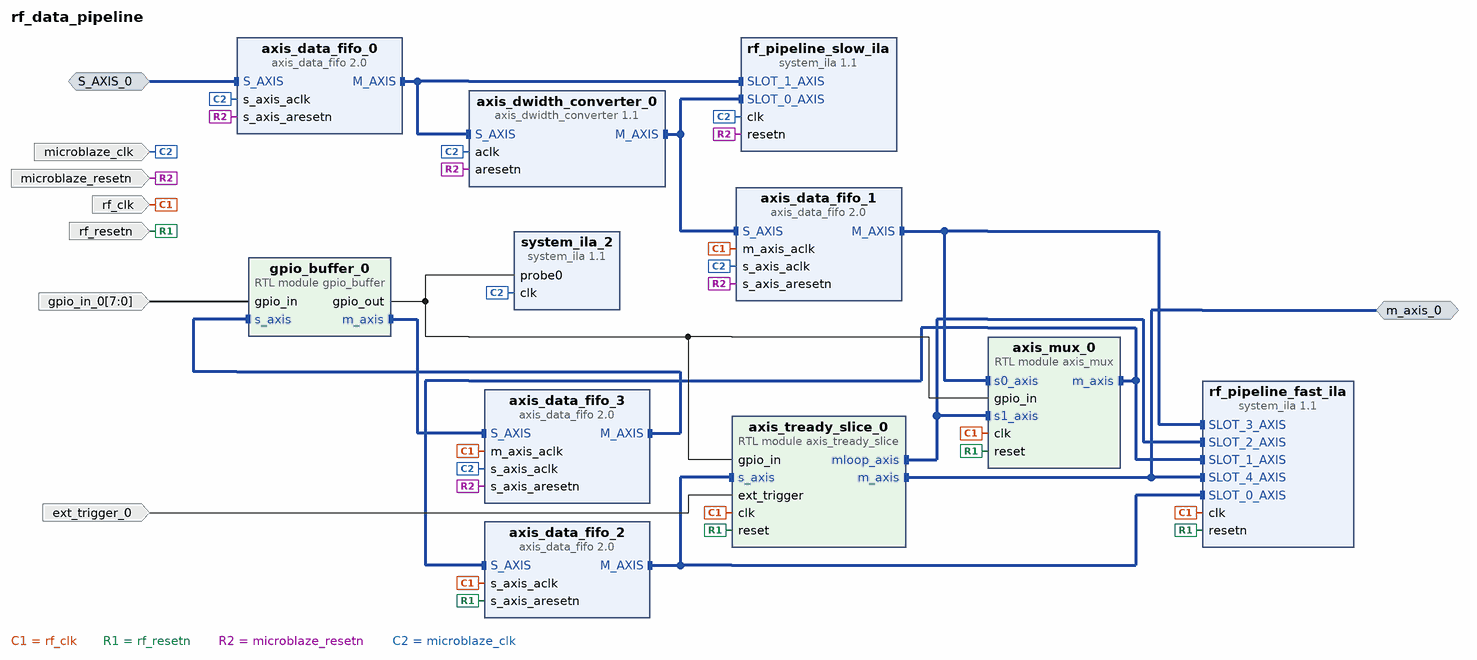
[diagram p0: block diagram of the top level]
# Vivado block design rf_data_pipeline, xczu29dr-ffvf1760-2-e, Vivado 2019.1
create_bd_design rf_data_pipeline

create_bd_intf_port -mode Slave -vlnv xilinx.com:interface:axis_rtl:1.0 S_AXIS_0
set_property -dict [list \
  CONFIG.HAS_TKEEP 0 \
  CONFIG.HAS_TLAST 0 \
  CONFIG.HAS_TREADY 1 \
  CONFIG.HAS_TSTRB 0 \
  CONFIG.LAYERED_METADATA undef \
  CONFIG.TDATA_NUM_BYTES 4 \
  CONFIG.TDEST_WIDTH 0 \
  CONFIG.TID_WIDTH 0 \
  CONFIG.TUSER_WIDTH 0 \
] [get_bd_intf_ports S_AXIS_0]
create_bd_intf_port -mode Master -vlnv xilinx.com:interface:axis_rtl:1.0 m_axis_0
set_property -dict {CONFIG.FREQ_HZ 250000000} [get_bd_intf_ports m_axis_0]
create_bd_port -dir I ext_trigger_0
create_bd_port -dir I -type clk rf_clk
set_property -dict {CONFIG.ASSOCIATED_RESET rf_resetn CONFIG.FREQ_HZ 250000000} [get_bd_ports rf_clk]
create_bd_port -dir I -type clk microblaze_clk
set_property -dict {CONFIG.ASSOCIATED_RESET microblaze_resetn CONFIG.FREQ_HZ 100000000} [get_bd_ports microblaze_clk]
create_bd_port -dir I -from 7 -to 0 gpio_in_0
create_bd_port -dir I -type rst microblaze_resetn
create_bd_port -dir I -type rst rf_resetn

create_bd_cell -type ip -vlnv xilinx.com:ip:axis_data_fifo:2.0 axis_data_fifo_0
set_property -dict {CONFIG.FIFO_DEPTH 16 CONFIG.HAS_TLAST 0 CONFIG.TDATA_NUM_BYTES 4} [get_bd_cells axis_data_fifo_0]
create_bd_cell -type ip -vlnv xilinx.com:ip:axis_dwidth_converter:1.1 axis_dwidth_converter_0
set_property -dict [list \
  CONFIG.HAS_MI_TKEEP 0 \
  CONFIG.HAS_TKEEP 0 \
  CONFIG.HAS_TLAST 0 \
  CONFIG.HAS_TSTRB 0 \
  CONFIG.M_TDATA_NUM_BYTES 32 \
  CONFIG.S_TDATA_NUM_BYTES 4 \
] [get_bd_cells axis_dwidth_converter_0]
create_bd_cell -type ip -vlnv xilinx.com:ip:axis_data_fifo:2.0 axis_data_fifo_1
set_property -dict [list \
  CONFIG.FIFO_DEPTH 64 \
  CONFIG.FIFO_MODE 1 \
  CONFIG.HAS_PROG_FULL 0 \
  CONFIG.HAS_TKEEP 0 \
  CONFIG.HAS_TLAST 0 \
  CONFIG.IS_ACLK_ASYNC 1 \
  CONFIG.TDATA_NUM_BYTES 32 \
] [get_bd_cells axis_data_fifo_1]
create_bd_cell -type ip -vlnv xilinx.com:ip:axis_data_fifo:2.0 axis_data_fifo_2
set_property -dict {CONFIG.FIFO_DEPTH 1024 CONFIG.TDATA_NUM_BYTES 32} [get_bd_cells axis_data_fifo_2]
create_bd_cell -type module -reference axis_mux axis_mux_0
create_bd_cell -type ip -vlnv xilinx.com:ip:system_ila:1.1 rf_pipeline_fast_ila
set_property -dict [list \
  CONFIG.ALL_PROBE_SAME_MU_CNT 1 \
  CONFIG.C_DATA_DEPTH 4096 \
  CONFIG.C_EN_STRG_QUAL 0 \
  CONFIG.C_MON_TYPE INTERFACE \
  CONFIG.C_NUM_MONITOR_SLOTS 5 \
  CONFIG.C_PROBE0_MU_CNT 1 \
  CONFIG.C_SLOT_0_APC_EN 0 \
  CONFIG.C_SLOT_0_AXI_DATA_SEL 1 \
  CONFIG.C_SLOT_0_AXI_TRIG_SEL 1 \
  CONFIG.C_SLOT_0_INTF_TYPE xilinx.com:interface:axis_rtl:1.0 \
  CONFIG.C_SLOT_1_APC_EN 0 \
  CONFIG.C_SLOT_1_AXI_DATA_SEL 1 \
  CONFIG.C_SLOT_1_AXI_TRIG_SEL 1 \
  CONFIG.C_SLOT_1_INTF_TYPE xilinx.com:interface:axis_rtl:1.0 \
  CONFIG.C_SLOT_2_APC_EN 0 \
  CONFIG.C_SLOT_2_AXI_DATA_SEL 1 \
  CONFIG.C_SLOT_2_AXI_TRIG_SEL 1 \
  CONFIG.C_SLOT_2_INTF_TYPE xilinx.com:interface:axis_rtl:1.0 \
  CONFIG.C_SLOT_3_APC_EN 0 \
  CONFIG.C_SLOT_3_AXI_DATA_SEL 1 \
  CONFIG.C_SLOT_3_AXI_TRIG_SEL 1 \
  CONFIG.C_SLOT_3_INTF_TYPE xilinx.com:interface:axis_rtl:1.0 \
  CONFIG.C_SLOT_4_APC_EN 0 \
  CONFIG.C_SLOT_4_AXI_DATA_SEL 1 \
  CONFIG.C_SLOT_4_AXI_TRIG_SEL 1 \
  CONFIG.C_SLOT_4_INTF_TYPE xilinx.com:interface:axis_rtl:1.0 \
] [get_bd_cells rf_pipeline_fast_ila]
create_bd_cell -type module -reference gpio_buffer gpio_buffer_0
create_bd_cell -type ip -vlnv xilinx.com:ip:axis_data_fifo:2.0 axis_data_fifo_3
set_property -dict {CONFIG.FIFO_DEPTH 16 CONFIG.IS_ACLK_ASYNC 1} [get_bd_cells axis_data_fifo_3]
create_bd_cell -type module -reference axis_tready_slice axis_tready_slice_0
create_bd_cell -type ip -vlnv xilinx.com:ip:system_ila:1.1 rf_pipeline_slow_ila
set_property -dict [list \
  CONFIG.C_MON_TYPE INTERFACE \
  CONFIG.C_NUM_MONITOR_SLOTS 2 \
  CONFIG.C_SLOT_0_APC_EN 0 \
  CONFIG.C_SLOT_0_AXI_DATA_SEL 1 \
  CONFIG.C_SLOT_0_AXI_TRIG_SEL 1 \
  CONFIG.C_SLOT_0_INTF_TYPE xilinx.com:interface:axis_rtl:1.0 \
  CONFIG.C_SLOT_1_APC_EN 0 \
  CONFIG.C_SLOT_1_AXI_DATA_SEL 1 \
  CONFIG.C_SLOT_1_AXI_TRIG_SEL 1 \
  CONFIG.C_SLOT_1_INTF_TYPE xilinx.com:interface:axis_rtl:1.0 \
] [get_bd_cells rf_pipeline_slow_ila]
create_bd_cell -type ip -vlnv xilinx.com:ip:system_ila:1.1 system_ila_2
set_property -dict {CONFIG.C_MON_TYPE NATIVE CONFIG.C_NUM_OF_PROBES 1 CONFIG.C_PROBE0_TYPE 0} [get_bd_cells system_ila_2]

# ---- connections ----

connect_bd_intf_net -intf_net axis_tready_slice_0_mloop_axis [get_bd_intf_pins axis_tready_slice_0/mloop_axis] [get_bd_intf_pins axis_mux_0/s1_axis]
connect_bd_intf_net [get_bd_intf_pins axis_tready_slice_0/mloop_axis] [get_bd_intf_pins rf_pipeline_fast_ila/SLOT_2_AXIS]
connect_bd_intf_net -intf_net axis_dwidth_converter_0_M_AXIS [get_bd_intf_pins axis_dwidth_converter_0/M_AXIS] [get_bd_intf_pins axis_data_fifo_1/S_AXIS]
connect_bd_intf_net [get_bd_intf_pins axis_dwidth_converter_0/M_AXIS] [get_bd_intf_pins rf_pipeline_slow_ila/SLOT_0_AXIS]
connect_bd_intf_net -intf_net axis_mux_0_m_axis [get_bd_intf_pins axis_mux_0/m_axis] [get_bd_intf_pins axis_data_fifo_2/S_AXIS]
connect_bd_intf_net [get_bd_intf_pins axis_mux_0/m_axis] [get_bd_intf_pins rf_pipeline_fast_ila/SLOT_1_AXIS]
connect_bd_intf_net [get_bd_intf_pins axis_data_fifo_3/M_AXIS] [get_bd_intf_pins gpio_buffer_0/s_axis]
connect_bd_intf_net -intf_net axis_tready_slice_0_m_axis [get_bd_intf_ports m_axis_0] [get_bd_intf_pins axis_tready_slice_0/m_axis]
connect_bd_intf_net [get_bd_intf_ports m_axis_0] [get_bd_intf_pins rf_pipeline_fast_ila/SLOT_4_AXIS]
connect_bd_intf_net -intf_net axis_data_fifo_0_M_AXIS [get_bd_intf_pins axis_data_fifo_0/M_AXIS] [get_bd_intf_pins axis_dwidth_converter_0/S_AXIS]
connect_bd_intf_net [get_bd_intf_pins axis_data_fifo_0/M_AXIS] [get_bd_intf_pins rf_pipeline_slow_ila/SLOT_1_AXIS]
connect_bd_intf_net -intf_net axis_data_fifo_1_M_AXIS [get_bd_intf_pins axis_data_fifo_1/M_AXIS] [get_bd_intf_pins axis_mux_0/s0_axis]
connect_bd_intf_net [get_bd_intf_pins axis_data_fifo_1/M_AXIS] [get_bd_intf_pins rf_pipeline_fast_ila/SLOT_3_AXIS]
connect_bd_intf_net -intf_net S_AXIS_0_1 [get_bd_intf_ports S_AXIS_0] [get_bd_intf_pins axis_data_fifo_0/S_AXIS]
connect_bd_intf_net [get_bd_intf_pins gpio_buffer_0/m_axis] [get_bd_intf_pins axis_data_fifo_3/S_AXIS]
connect_bd_intf_net -intf_net axis_data_fifo_2_M_AXIS [get_bd_intf_pins axis_data_fifo_2/M_AXIS] [get_bd_intf_pins axis_tready_slice_0/s_axis]
connect_bd_intf_net [get_bd_intf_pins axis_data_fifo_2/M_AXIS] [get_bd_intf_pins rf_pipeline_fast_ila/SLOT_0_AXIS]
connect_bd_net [get_bd_ports rf_clk] \
  [get_bd_pins axis_data_fifo_2/s_axis_aclk] [get_bd_pins axis_mux_0/clk] [get_bd_pins axis_data_fifo_1/m_axis_aclk] \
  [get_bd_pins rf_pipeline_fast_ila/clk] [get_bd_pins axis_data_fifo_3/m_axis_aclk] [get_bd_pins axis_tready_slice_0/clk]
connect_bd_net [get_bd_ports rf_resetn] \
  [get_bd_pins axis_data_fifo_2/s_axis_aresetn] [get_bd_pins axis_mux_0/reset] [get_bd_pins rf_pipeline_fast_ila/resetn] \
  [get_bd_pins axis_tready_slice_0/reset]
connect_bd_net [get_bd_ports microblaze_resetn] \
  [get_bd_pins axis_data_fifo_0/s_axis_aresetn] [get_bd_pins axis_dwidth_converter_0/aresetn] \
  [get_bd_pins axis_data_fifo_1/s_axis_aresetn] [get_bd_pins axis_data_fifo_3/s_axis_aresetn] \
  [get_bd_pins rf_pipeline_slow_ila/resetn]
connect_bd_net [get_bd_ports microblaze_clk] \
  [get_bd_pins axis_data_fifo_1/s_axis_aclk] [get_bd_pins axis_dwidth_converter_0/aclk] \
  [get_bd_pins axis_data_fifo_0/s_axis_aclk] [get_bd_pins axis_data_fifo_3/s_axis_aclk] \
  [get_bd_pins rf_pipeline_slow_ila/clk] [get_bd_pins system_ila_2/clk]
connect_bd_net -net ext_trigger_0_1 [get_bd_ports ext_trigger_0] [get_bd_pins axis_tready_slice_0/ext_trigger]
connect_bd_net -net gpio_in_0_1 [get_bd_pins gpio_buffer_0/gpio_out] \
  [get_bd_pins axis_mux_0/gpio_in] [get_bd_pins axis_tready_slice_0/gpio_in] [get_bd_pins system_ila_2/probe0]
connect_bd_net -net gpio_in_0_2 [get_bd_ports gpio_in_0] [get_bd_pins gpio_buffer_0/gpio_in]
set_property HDL_ATTRIBUTE.DEBUG true [get_bd_intf_nets axis_tready_slice_0_mloop_axis]
set_property HDL_ATTRIBUTE.MARK_DEBUG true [get_bd_intf_nets axis_tready_slice_0_mloop_axis]
set_property HDL_ATTRIBUTE.DEBUG true [get_bd_intf_nets axis_dwidth_converter_0_M_AXIS]
set_property HDL_ATTRIBUTE.MARK_DEBUG true [get_bd_intf_nets axis_dwidth_converter_0_M_AXIS]
set_property HDL_ATTRIBUTE.DEBUG true [get_bd_intf_nets axis_mux_0_m_axis]
set_property HDL_ATTRIBUTE.MARK_DEBUG true [get_bd_intf_nets axis_mux_0_m_axis]
set_property HDL_ATTRIBUTE.DEBUG true [get_bd_intf_nets axis_tready_slice_0_m_axis]
set_property HDL_ATTRIBUTE.MARK_DEBUG true [get_bd_intf_nets axis_tready_slice_0_m_axis]
set_property HDL_ATTRIBUTE.DEBUG true [get_bd_intf_nets axis_data_fifo_0_M_AXIS]
set_property HDL_ATTRIBUTE.MARK_DEBUG true [get_bd_intf_nets axis_data_fifo_0_M_AXIS]
set_property HDL_ATTRIBUTE.DEBUG true [get_bd_intf_nets axis_data_fifo_1_M_AXIS]
set_property HDL_ATTRIBUTE.MARK_DEBUG true [get_bd_intf_nets axis_data_fifo_1_M_AXIS]
set_property HDL_ATTRIBUTE.DEBUG true [get_bd_intf_nets axis_data_fifo_2_M_AXIS]
set_property HDL_ATTRIBUTE.MARK_DEBUG true [get_bd_intf_nets axis_data_fifo_2_M_AXIS]
set_property HDL_ATTRIBUTE.DEBUG true [get_bd_nets gpio_in_0_1]
set_property HDL_ATTRIBUTE.MARK_DEBUG true [get_bd_nets gpio_in_0_1]

validate_bd_design
save_bd_design
